# Altium schematic sheet LM_HTR_001.SchDoc: Land Meter Heater Assembly
size Tabloid; DocumentNumber: LM_HTR_001; Revision: A; SheetNumber: 1; SheetTotal: 1
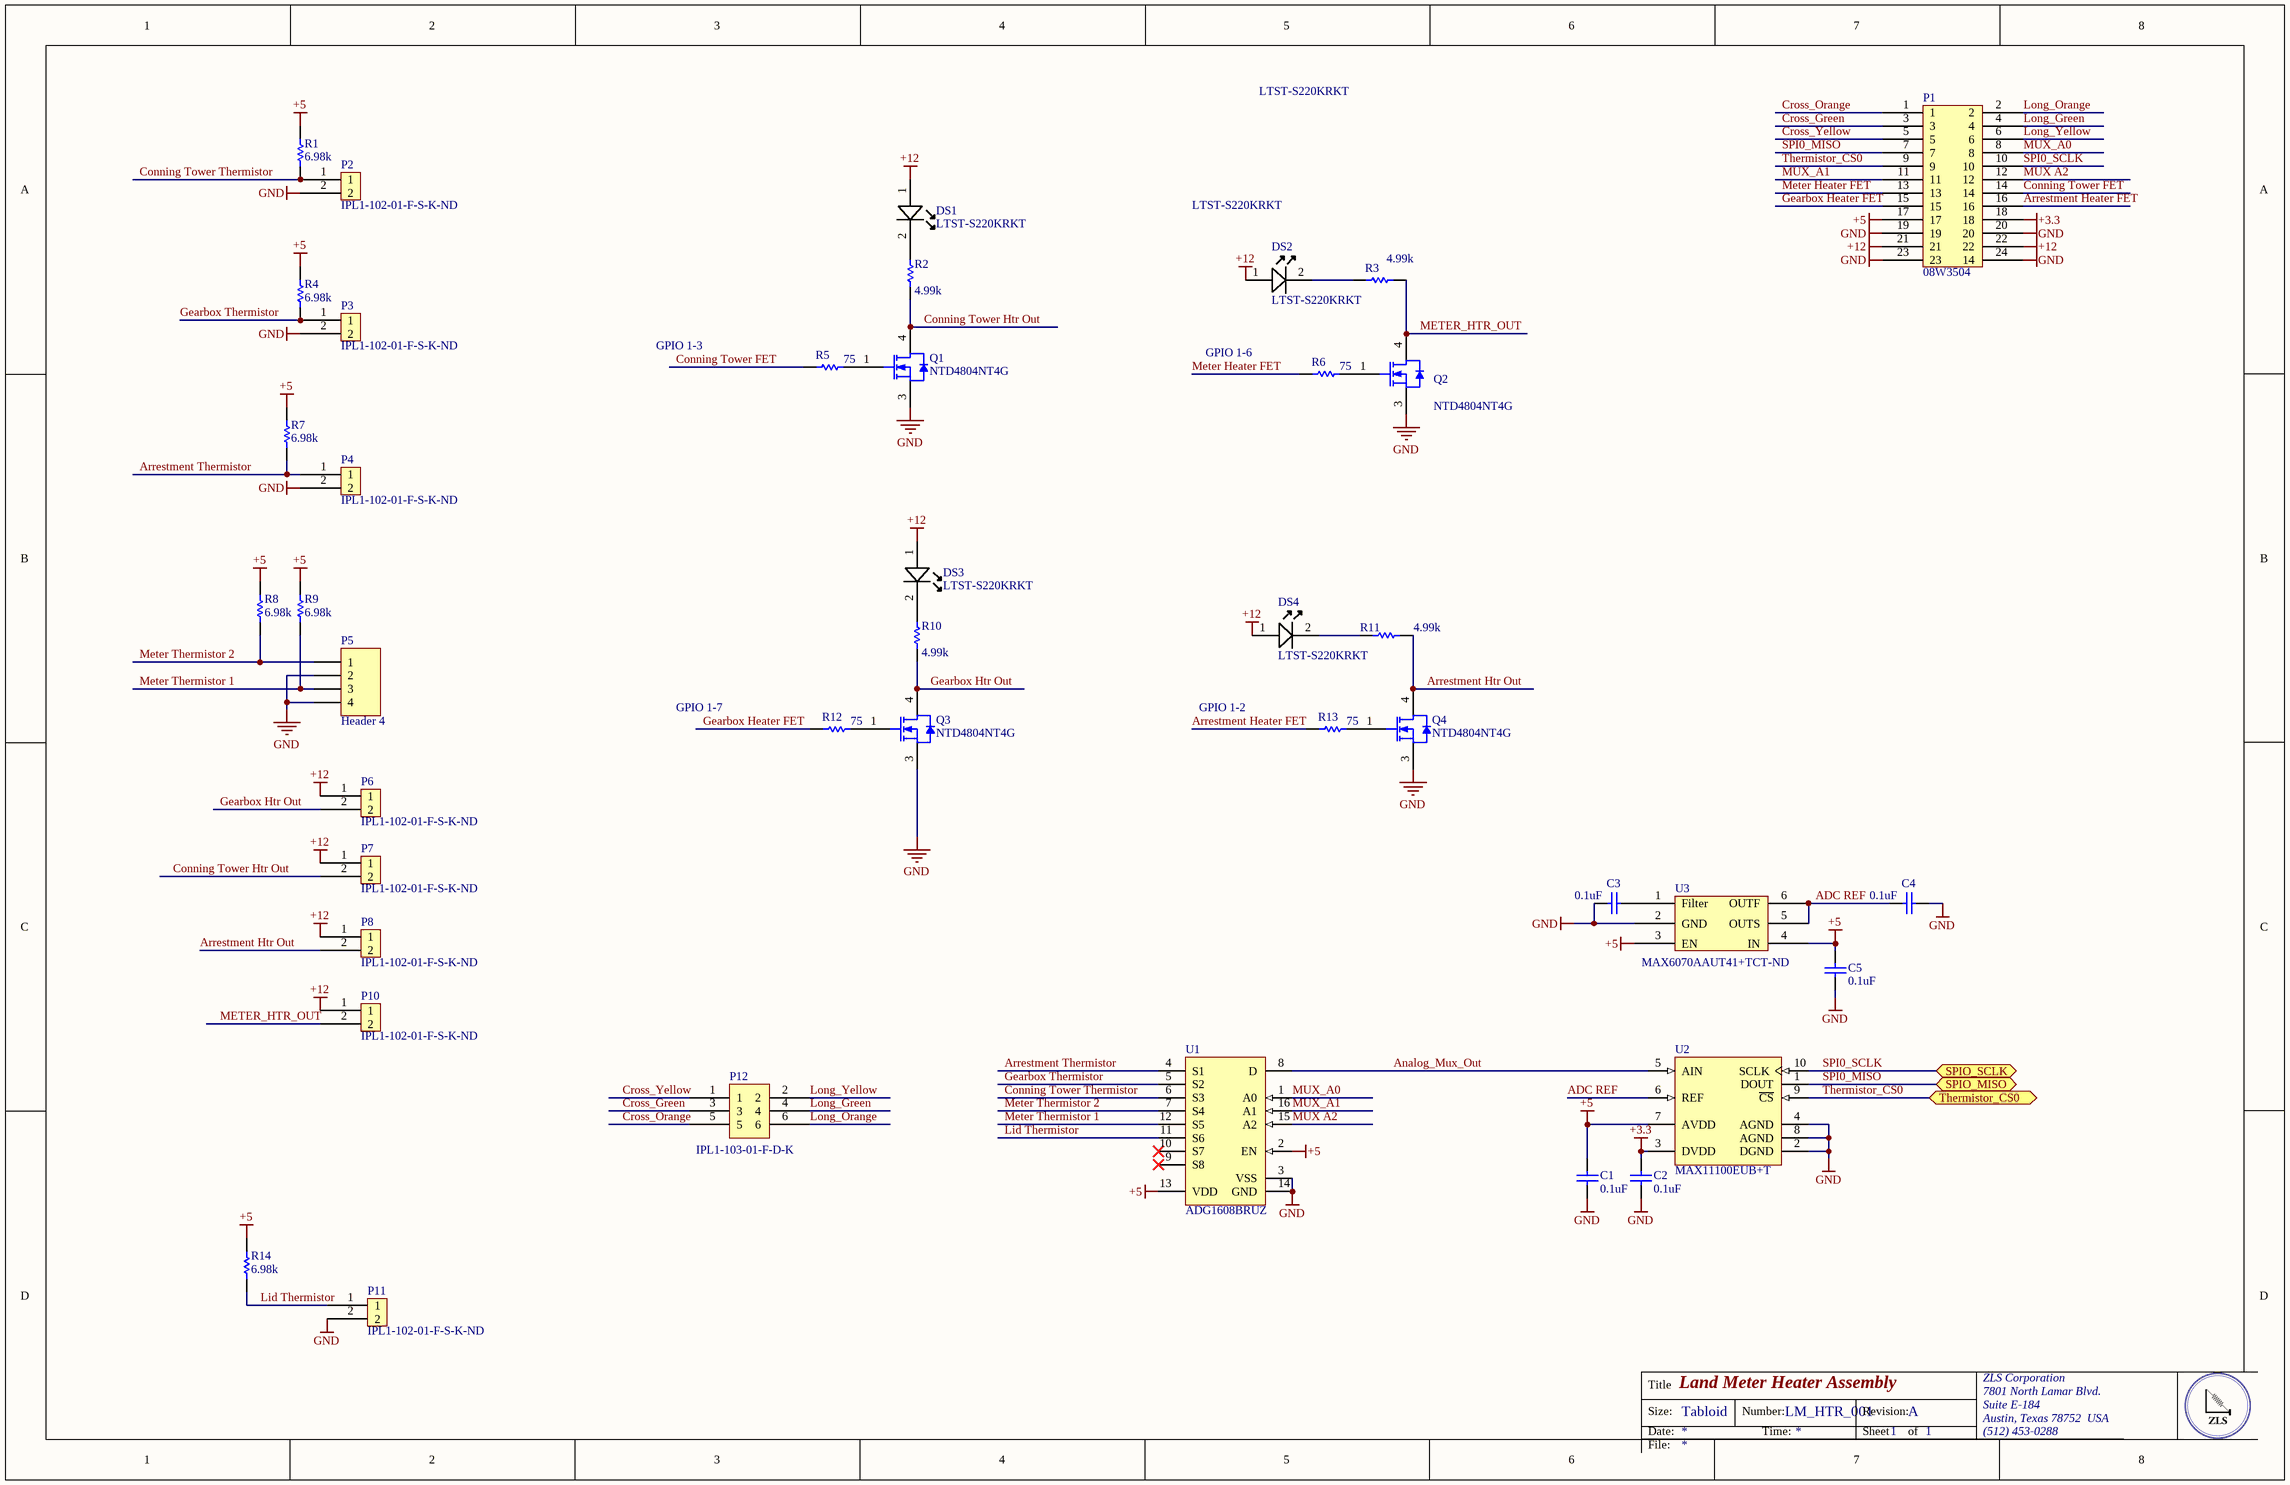
[diagram p0: LM_HTR_001.SchDoc]

## Parts
C1  0.1uF  [CAPC0402(1005)60_L]
C2  0.1uF  [CAPC0402(1005)60_L]
C3  0.1uF  [CAPC0402(1005)60_L]
C4  0.1uF  [CAPC0402(1005)60_L]
C5  0.1uF  [CAPC0402(1005)60_L]
DS1  Manufacturer Part Number: LTST-S220KRKT  [0805C_L]  (hidden comment: Visible Name Value Type    False Description Lite-On LTST-S220KRKT Red LED, 631 nm 2012 (0805) Side View, Rectangle Lens SMD package STRING)
DS2  Manufacturer Part Number: LTST-S220KRKT  [0805C_L]  (hidden comment: Visible Name Value Type    False Description Lite-On LTST-S220KRKT Red LED, 631 nm 2012 (0805) Side View, Rectangle Lens SMD package STRING)
DS3  Manufacturer Part Number: LTST-S220KRKT  [0805C_L]  (hidden comment: Visible Name Value Type    False Description Lite-On LTST-S220KRKT Red LED, 631 nm 2012 (0805) Side View, Rectangle Lens SMD package STRING)
DS4  Manufacturer Part Number: LTST-S220KRKT  [0805C_L]  (hidden comment: Visible Name Value Type    False Description Lite-On LTST-S220KRKT Red LED, 631 nm 2012 (0805) Side View, Rectangle Lens SMD package STRING)
P1  Supplier Part Number 1: 08W3504  [IPL1-112-01-F-S-K]  (hidden comment: IPL1-112-01-F-S-K)
P2  Supplier Part Number 1: IPL1-102-01-F-S-K-ND  [IPL1-102-01-F-S-K]  (hidden comment: IPL1-102-01-F-S-K)
P3  Supplier Part Number 1: IPL1-102-01-F-S-K-ND  [IPL1-102-01-F-S-K]  (hidden comment: IPL1-102-01-F-S-K)
P4  Supplier Part Number 1: IPL1-102-01-F-S-K-ND  [IPL1-102-01-F-S-K]  (hidden comment: IPL1-102-01-F-S-K)
P5  Header 4  [IPL1-104-01-L-S-K]
P6  Supplier Part Number 1: IPL1-102-01-F-S-K-ND  [IPL1-102-01-F-S-K]  (hidden comment: IPL1-102-01-F-S-K)
P7  Supplier Part Number 1: IPL1-102-01-F-S-K-ND  [IPL1-102-01-F-S-K]  (hidden comment: IPL1-102-01-F-S-K)
P8  Supplier Part Number 1: IPL1-102-01-F-S-K-ND  [IPL1-102-01-F-S-K]  (hidden comment: IPL1-102-01-F-S-K)
P10  Supplier Part Number 1: IPL1-102-01-F-S-K-ND  [IPL1-102-01-F-S-K]  (hidden comment: IPL1-102-01-F-S-K)
P11  Supplier Part Number 1: IPL1-102-01-F-S-K-ND  [IPL1-102-01-F-S-K]  (hidden comment: IPL1-102-01-F-S-K)
P12  Manufacturer Part Number: IPL1-103-01-F-D-K  [IPL1-103-01-F-D]  (hidden comment: IPL1-103-01-F-D)
Q1  NTD4804NT4G  [ONSC-DPAK-3-369AA-01_V]
Q2  NTD4804NT4G  [ONSC-DPAK-3-369AA-01_V]
Q3  NTD4804NT4G  [ONSC-DPAK-3-369AA-01_V]
Q4  NTD4804NT4G  [ONSC-DPAK-3-369AA-01_V]
R1  Resistance (Ohms): 6.98k  [RESC0805(2012)_N]  (hidden comment: 6K98 1% 0805(2012))
R2  Resistance (Ohms): 4.99k  [RESC0805(2012)_L]
R3  Resistance (Ohms): 4.99k  [RESC0805(2012)_L]
R4  Resistance (Ohms): 6.98k  [RESC0805(2012)_N]  (hidden comment: 6K98 1% 0805(2012))
R5  Resistance (Ohms): 75  [RESC0805(2012)_L]
R6  Resistance (Ohms): 75  [RESC0805(2012)_L]
R7  Resistance (Ohms): 6.98k  [RESC0805(2012)_N]  (hidden comment: 6K98 1% 0805(2012))
R8  Resistance (Ohms): 6.98k  [RESC0805(2012)_N]  (hidden comment: 6K98 1% 0805(2012))
R9  Resistance (Ohms): 6.98k  [RESC0805(2012)_N]  (hidden comment: 6K98 1% 0805(2012))
R10  Resistance (Ohms): 4.99k  [RESC0805(2012)_L]
R11  Resistance (Ohms): 4.99k  [RESC0805(2012)_L]
R12  Resistance (Ohms): 75  [RESC0805(2012)_L]
R13  Resistance (Ohms): 75  [RESC0805(2012)_L]
R14  Resistance (Ohms): 6.98k  [RESC0805(2012)_N]  (hidden comment: 6K98 1% 0805(2012))
U1  ADG1608BRUZ  [ADI-RU-16_M]
U2  MAX11100EUB+T  [U10+2_L]
U3  Supplier Part Number 1: MAX6070AAUT41+TCT-ND  [SOT95P280X445-6N]  (hidden comment: MAX6070AAUT41+T)

## Ports
SPIO_MISO, SPIO_SCLK, Thermistor_CS0

## Nets
+3.3: C2.1 P1.18 U2.3(DVDD)
+5: C1.1 C5.1 P1.17 R1.2 R4.2 R7.1 R8.1 R9.2 R14.1 U1.2(EN) U1.13(VDD) U2.7(AVDD) U3.3(EN) U3.4(IN)
+12: DS1.1(A) DS2.1(A) DS3.1(A) DS4.1(A) P1.21 P1.22 P6.1 P7.1 P8.1 P10.1
GND: C1.2 C2.2 C3.2 C4.1 C5.2 P1.19 P1.20 P1.23 P1.24(14) P2.2 P3.2 P4.2 P5.2 P5.4 P11.2 Q1.3(S) Q2.3(S) Q3.3(S) Q4.3(S) U1.3(VSS) U1.14(GND) U2.2(DGND) U2.4(AGND) U2.8(AGND) U3.2(GND)
ADC REF: C4.2 U2.6(REF) U3.5(OUTS) U3.6(OUTF)
Analog_Mux_Out: U1.8(D) U2.5(AIN)
Arrestment Heater FET: P1.16 R13.1
Arrestment Htr Out: P8.2 Q4.4(D) R11.2
Arrestment Thermistor: P4.1 R7.2 U1.4(S1)
Conning Tower FET: P1.14 R5.1
Conning Tower Htr Out: P7.2 Q1.4(D) R2.1
Conning Tower Thermistor: P2.1 R1.1 U1.6(S3)
Cross_Green: P1.3 P12.3
Cross_Orange: P1.1 P12.5
Cross_Yellow: P1.5 P12.1
Gearbox Heater FET: P1.15 R12.1
Gearbox Htr Out: P6.2 Q3.4(D) R10.1
Gearbox Thermistor: P3.1 R4.1 U1.5(S2)
Lid Thermistor: P11.1 R14.2 U1.11(S6)
Long_Green: P1.4 P12.4
Long_Orange: P1.2 P12.6
Long_Yellow: P1.6 P12.2
Meter Heater FET: P1.13 R6.1
Meter Thermistor 1: P5.3 R9.1 U1.12(S5)
Meter Thermistor 2: P5.1 R8.2 U1.7(S4)
METER_HTR_OUT: P10.2 Q2.4(D) R3.2
MUX A2: P1.12 U1.15(A2)
MUX_A0: P1.8 U1.1(A0)
MUX_A1: P1.11 U1.16(A1)
SPI0_MISO: P1.7 U2.1(DOUT) ; port SPIO_MISO
SPI0_SCLK: P1.10 U2.10(SCLK) ; port SPIO_SCLK
Thermistor_CS0: P1.9 U2.9(~{CS}) ; port Thermistor_CS0
NetC3_1: C3.1 U3.1(Filter)
NetDS1_2: DS1.2(K) R2.2
NetDS2_2: DS2.2(K) R3.1
NetDS3_2: DS3.2(K) R10.2
NetDS4_2: DS4.2(K) R11.1
NetQ1_1: Q1.1(G) R5.2
NetQ2_1: Q2.1(G) R6.2
NetQ3_1: Q3.1(G) R12.2
NetQ4_1: Q4.1(G) R13.2

Not connected (* = marked no-connect by the designer): U1 9(S8)* 10(S7)*

## Notes on the sheet
- LTST-S220KRKT
- GPIO 1-3
- GPIO 1-6
- GPIO 1-7
- GPIO 1-2
- Title
- Size:
- Date:
- Tabloid
- Number:
- Time:
- Revision:
- Sheet
- of
- ZLS Corporation
- 7801 North Lamar Blvd.
- Suite E-184
- Austin, Texas 78752  USA
- (512) 453-0288
- File:

## Library data of the parts
C1-C5 = CMP-1034-00252-1: CAP CER 0.1UF 10V X7R 0402; Manufacturer: Murata Electronics North America; Manufacturer Part Number: GRM155R71A104KA01D; Tolerance: ±10%; Supplier 1: Digi-Key; Supplier Part Number 1: 490-6321-1-ND; RoHS: RoHS Compliant; Category: Capacitors; Stock 1: 2920395; Pricing 1: 1=0.1, 10=0.014, 100=0.0063, 500=0.00446, 1000=0.00351, 2500=0.00319, 5000=0.00293 (USD); Packaging: Cut Tape (CT); Part Status: Active; Voltage - Rated: 10V; Temperature Coefficient: X7R; Operating Temperature: -55°C ~ 125°C; Features: -; Ratings: -; Applications: General Purpose; Mounting Type: Surface Mount, MLCC; Package / Case: 0402 (1005 Metric); Size / Dimension: 0.039" L x 0.020" W (1.00mm x 0.50mm); Height - Seated (Max): -; Thickness (Max): 0.022" (0.55mm); Lead Spacing: -; ComponentLink1URL: http://www.murata.com/~/media/webrenewal/support/library/catalog/products/capacitor/mlcc/c02e.ashx?la=en-us; ComponentLink1Description: http://www.murata.com/~/media/webrenewal/support/library/catalog/products/capacitor/mlcc/c02e.ashx?la=en-us
DS1-DS4 = LED A/K: Manufacturer: Vishay / Lite-On; Lens Colour: Colorless; Lens Style: Diffused,Colorless; Viewing Angle: 130°; Luminous Intensity: 54mcd; Forward Current: 20mA; Forward Voltage: 2V; Power Rating: 75mW; Dominant Wavelength: 631nm; Lens Transparency: Clear; Number of Elements: 1; Wavelength: 639nm; Supplier 1: Digi-Key; Supplier Part Number 1: 160-1469-1-ND; Stock 1: 108191; Pricing 1: 1=0.31, 10=0.225, 25=0.1656, 100=0.1183, 250=0.0804, 500=0.071, 1000=0.0556 (USD); Mount: Surface Mount; Case/Package: 0805; Number of Pins: 2; Colour: Red; Case Code (Metric): 2012; Case Code (Imperial): 0805; Min Operating Temperature: -55°C; Max Operating Temperature: 85°C; Packaging: Tape and Reel; Package Quantity: 4000; Illumination Colour: Red; Test Current: 20mA; Power Dissipation: 75mW; Number of LEDs: 1; Length: 2.1mm; Height: 0.6mm; Width: 1mm; Depth: 0.6mm; Radiation Hardening: No; Lead Free: Lead Free; ComponentLink1URL: https://datasheet.ciiva.com/2110/s-110-ltst-s220krkt-2110132.pdf; ComponentLink1Description: https://datasheet.ciiva.com/2110/s-110-ltst-s220krkt-2110132.pdf; ComponentLink2URL: https://datasheet.ciiva.com/2110/s-110-ltst-s220krkt-2110133.pdf; ComponentLink2Description: https://datasheet.ciiva.com/2110/s-110-ltst-s220krkt-2110133.pdf; ComponentLink3URL: https://datasheet.ciiva.com/2110/s-110-ltst-s220krkt-2110134.pdf; ComponentLink3Description: https://datasheet.ciiva.com/2110/s-110-ltst-s220krkt-2110134.pdf; ComponentLink4URL: https://datasheet.ciiva.com/12403/lite-on-ltst-s220krkt-187389-12403798.pdf; ComponentLink4Description: https://datasheet.ciiva.com/12403/lite-on-ltst-s220krkt-187389-12403798.pdf; ComponentLink5URL: https://datasheet.ciiva.com/16345/lite-onltst-s220krkt-16345511.pdf; ComponentLink5Description: https://datasheet.ciiva.com/16345/lite-onltst-s220krkt-16345511.pdf; ComponentLink6URL: https://datasheet.ciiva.com/15118/getdatasheetpartid-225752-15118120.pdf; ComponentLink6Description: https://datasheet.ciiva.com/15118/getdatasheetpartid-225752-15118120.pdf; ComponentLink7URL: https://datasheet.ciiva.com/14633/0900766b80dc0b76-14633737.pdf; ComponentLink7Description: https://datasheet.ciiva.com/14633/0900766b80dc0b76-14633737.pdf; ComponentLink8URL: https://datasheet.ciiva.com/11775/0900766b80dc0b76-11775439.pdf; ComponentLink8Description: https://datasheet.ciiva.com/11775/0900766b80dc0b76-11775439.pdf
P1 = IPL1-112-01-F-S-K: IPL1-112-01-F-D-K; Supplier 1: Newark
P2-P4 P6-P8 P10 P11 = IPL1-102-01-F-S-K: .100 TERMINAL ASSEMBLY; Manufacturer: Samtec Inc.; Connector Type: Header; Pitch - Mating: 0.100" (2.54mm); Number of Positions: 2; Number of Positions Loaded: All; Style: Board to Cable/Wire; Shrouding: Shrouded - 4 Wall; Contact Length - Mating: 0.215" (5.46mm); Contact Length - Post: 0.120" (3.05mm); Material Flammability Rating: UL94 V-0; Voltage Rating: 675VAC, 954VDC; Supplier 1: Digi-Key; Manufacturer Part Number: IPL1-102-01-F-S-K; RoHS: RoHS Compliant; Category: Connectors, Interconnects; Stock 1: 0; Pricing 1: 1=1.69 (USD); Packaging: Tube; Part Status: Active; Contact Type: Male Pin; Number of Rows: 1; Row Spacing - Mating: -; Mounting Type: Through Hole; Termination: Solder; Fastening Type: Locking Ramp; Overall Contact Length: -; Insulation Height: 0.320" (8.13mm); Contact Shape: Square; Contact Finish - Mating: Gold; Contact Finish Thickness - Mating: 3µin (0.08µm); Contact Finish - Post: Tin; Contact Material: Phosphor Bronze; Insulation Material: Liquid Crystal Polymer (LCP); Features: -; Operating Temperature: -55°C ~ 125°C; Ingress Protection: -; Insulation Color: Natural; Current Rating: -; Mated Stacking Heights: -; Contact Finish Thickness - Post: -; Applications: -; ComponentLink1URL: http://suddendocs.samtec.com/prints/ipl1-1xx-xx-xxx-s-xx-x-xx-mkt.pdf; ComponentLink1Description: http://suddendocs.samtec.com/prints/ipl1-1xx-xx-xxx-s-xx-x-xx-mkt.pdf
P5 = Header 4: Header, 4-Pin; LatestRevisionDate: 17-Jul-2002; LatestRevisionNote: Re-released for DXP Platform.; Publisher: Altium Limited
P12 = IPL1-103-01-F-D: Manufacturer: SAMTEC; Supplier 1: Newark; Supplier Part Number 1: 51P2678; Stock 1: 0; Pricing 1: 1=1.8, 5000=1.56, 10000=1.46 (USD); ComponentLink1URL: https://webassistants.partcommunity.com/23d-libs/samtec/search/resolve.html?EMAIL=mysamtec@samtec.com&PN=HTSW-114-05-F-D; ComponentLink1Description: https://webassistants.partcommunity.com/23d-libs/samtec/search/resolve.html?EMAIL=mysamtec@samtec.com&PN=HTSW-114-05-F-D
Q1-Q4 = CMP-1058-00341-1: Power MOSFET, 30 V, 117 A, Single N-Channel, 3-Pin DPAK, Pb-Free, Tape and Reel; Manufacturer: On Semiconductor; Coss Typ (pF): 952; Qrr Typ (nC): 30; VGS Max (V): 20; ID Max (A): 117; Crss Typ (pF): 556; Channel Polarity: N Channel; Ciss Typ (pF): 4490; VGS(th) Max (V): 2.5; ComponentLink2Description: Datasheet; ComponentLink3Description: Package Specification; Mounting Technology: Surface Mount; PackageDescription: 3-Pin Flange Mount, Body 6.54 x 6.095 mm, Pitch 2.29 mm; PackageVersion: Rev. B, 06/2010; PartNumber: NTD4804NT4G; ComponentLink2URL: http://www.onsemi.cn/pub_link/Collateral/NTD4804N-D.PDF; RoHS: Pb-Free; Configuration: Single; DatasheetVersion: Rev. 8; PackageReference: DPAK-3-369AA-01; ComponentLink3URL: http://www.onsemi.cn/pub_link/Collateral/369AA.PDF; ComponentLink1Description: Manufacturer URL; Packing: Tape and Reel; Package Type: DPAK-3; ComponentLink1URL: http://www.onsemi.com/; V(BR)DSS Min (V): 30; Supplier 1: Digi-Key; Supplier Part Number 1: NTD4804NT4GOSDKR-ND
R1 R4 R7-R9 R14 = CMP-1013-00606-1: 6K98 0.125W 1% 0805 (2012 Metric)  SMD; Manufacturer: Vishay Dale; Manufacturer Part Number: CRCW08056K98FKEA; Power (Watts): 0.125W, 1/8W; Temperature Coefficient: ±100ppm/°C; Supplier 1: Digi-Key; Supplier Part Number 1: 541-6.98KCCT-ND; RoHS: RoHS Compliant; Category: Resistors; Stock 1: 34245; Pricing 1: 1=0.1, 10=0.044, 100=0.0178, 1000=0.00802, 2500=0.00696 (USD); Packaging: Cut Tape (CT); Part Status: Active; Tolerance: ±1%; Composition: Thick Film; Features: Automotive AEC-Q200; Operating Temperature: -55°C ~ 155°C; Package / Case: 0805 (2012 Metric); Supplier Device Package: 0805; Size / Dimension: 0.079" L x 0.049" W (2.00mm x 1.25mm); Height - Seated (Max): 0.020" (0.50mm); Failure Rate: -; ComponentLink1URL: http://www.vishay.com/docs/20035/dcrcwe3.pdf; ComponentLink1Description: http://www.vishay.com/docs/20035/dcrcwe3.pdf
R2 R3 R10 R11 = CMP-1013-00393-1: Manufacturer: Vishay Dale; Manufacturer Part Number: CRCW08054K99FKEA; Tolerance: ±1%; Power (Watts): 0.125W, 1/8W; Temperature Coefficient: ±100ppm/°C; Supplier 1: Digi-Key; Supplier Part Number 1: 541-4.99KCCT-ND; RoHS: RoHS Compliant; Category: Resistors; Stock 1: 93740; Pricing 1: 1=0.1, 10=0.044, 100=0.0178, 1000=0.00802, 2500=0.00696 (USD); Packaging: Cut Tape (CT); Part Status: Active; Composition: Thick Film; Features: Automotive AEC-Q200; Operating Temperature: -55°C ~ 155°C; Package / Case: 0805 (2012 Metric); Supplier Device Package: 0805; Size / Dimension: 0.079" L x 0.049" W (2.00mm x 1.25mm); Height - Seated (Max): 0.020" (0.50mm); Failure Rate: -; ComponentLink1URL: http://www.vishay.com/docs/20035/dcrcwe3.pdf; ComponentLink1Description: http://www.vishay.com/docs/20035/dcrcwe3.pdf
R5 R6 R12 R13 = CMP-1013-00393-1: Manufacturer: Vishay Dale; Manufacturer Part Number: CRCW080575R0FKEA; Tolerance: ±1%; Power (Watts): 0.125W, 1/8W; Temperature Coefficient: ±100ppm/°C; Supplier 1: Digi-Key; Supplier Part Number 1: 541-75.0CCT-ND; RoHS: RoHS Compliant; Category: Resistors; Stock 1: 32546; Pricing 1: 1=0.1, 10=0.044, 100=0.0178, 1000=0.00802, 2500=0.00696 (USD); Packaging: Cut Tape (CT); Part Status: Active; Composition: Thick Film; Features: Automotive AEC-Q200; Operating Temperature: -55°C ~ 155°C; Package / Case: 0805 (2012 Metric); Supplier Device Package: 0805; Size / Dimension: 0.079" L x 0.049" W (2.00mm x 1.25mm); Height - Seated (Max): 0.020" (0.50mm); Failure Rate: -; ComponentLink1URL: http://www.vishay.com/docs/20035/dcrcwe3.pdf; ComponentLink1Description: http://www.vishay.com/docs/20035/dcrcwe3.pdf
U1 = CMP-0793-00136-1: 4.5 Ohm Ron, 8-Channel +/-5 V,+12 V, +5 V and +3.3 V Multiplexer, 16-pin SOP (RU-16), Tube; Manufacturer: Analog Devices; Max Analog Signal Range: 0 to Vdd; Ron (ohms): 4.4; t transition (s): 150n; Bandwidth (Hz): 40M, 40M, 37M, 34M; Code_JEDEC: MO-153AB; PackageReference: RU-16; PackageDescription: 16-Pin Thin Shrink Small Outline Package, Body 5 x 4.4 mm, Pitch 0.65 mm; ComponentLink1Description: Manufacturer URL; ComponentLink2Description: Datasheet; PartNumber: ADG1608BRUZ; Mounting Technology: Surface Mount; PackageVersion: Nov-02; ComponentLink3Description: Package Specification; DatasheetVersion: Rev. 0; Packing: Tube; ComponentLink1URL: http://www.analog.com/en/index.html; ComponentLink3URL: http:/www.analog.com/static/imported-files/packages/36244347913743854010197452789RU16.pdf; ComponentLink2URL: http://www.analog.com/static/imported-files/data_sheets/ADG1608_1609.pdf
U2 = CMP-0249-00017-1: 16-Bit, +5V, 200ksps ADC with 10uA Shutdown, 10-Pin uMAX, -40°C to +85°C, Pb-Free, Tape and Reel; DatasheetVersion: Rev 1, Jan-2012; ComponentLink3URL: http://pdfserv.maxim-ic.com/package_dwgs/21-0061.PDF; PackageReference: U10+2; ComponentLink2URL: http://datasheets.maxim-ic.com/en/ds/MAX11100.pdf; PackageVersion: revL, 2008; ComponentLink1Description: Manufacturer URL; Code_JEDEC: MO-187-BA; ComponentLink1URL: http://www.maxim-ic.com; ComponentLink3Description: Package Specification; PackageDescription: 10-Pin Micro-MAX Thin Shrink Small Outline (uSOP), 3 x 3 x 0.85 mm Body, 0.5 mm Pitch, Pb-Free; ComponentLink2Description: Datasheet
U3 = MAX6070AAUT41+T: IC VREF SERIES 4.096V SOT23; Manufacturer: Maxim Integrated; Output Type: Fixed; Tolerance: ±0.04%; Temperature Coefficient: 6ppm/°C; Noise - 0.1Hz to 10Hz: 9.6µVp-p; Noise - 10Hz to 10kHz: 9µVrms; Voltage - Input: 4.3 V ~ 5.5 V; Current - Supply: 350µA; Supplier 1: Digi-Key; Manufacturer Part Number: MAX6070AAUT41+T; RoHS: RoHS Compliant; Category: Integrated Circuits (ICs); Stock 1: 2623; Pricing 1: 1=3.41, 10=3.213, 25=2.5704, 50=2.4418, 100=2.2491, 250=2.13344, 500=2.05634 (USD); Packaging: Cut Tape (CT); Part Status: Active; Reference Type: Series; Voltage - Output (Min/Fixed): 4.096V; Operating Temperature: -40°C ~ 125°C (TA); Mounting Type: Surface Mount; Package / Case: SOT-23-6; Supplier Device Package: SOT-23-6; ComponentLink1URL: https://datasheets.maximintegrated.com/en/ds/MAX6070-MAX6071.pdf; ComponentLink1Description: https://datasheets.maximintegrated.com/en/ds/MAX6070-MAX6071.pdf